# Altium schematic sheet [03] - WI-FI MODULE.SchDoc: Desk Digital Clock
size A4
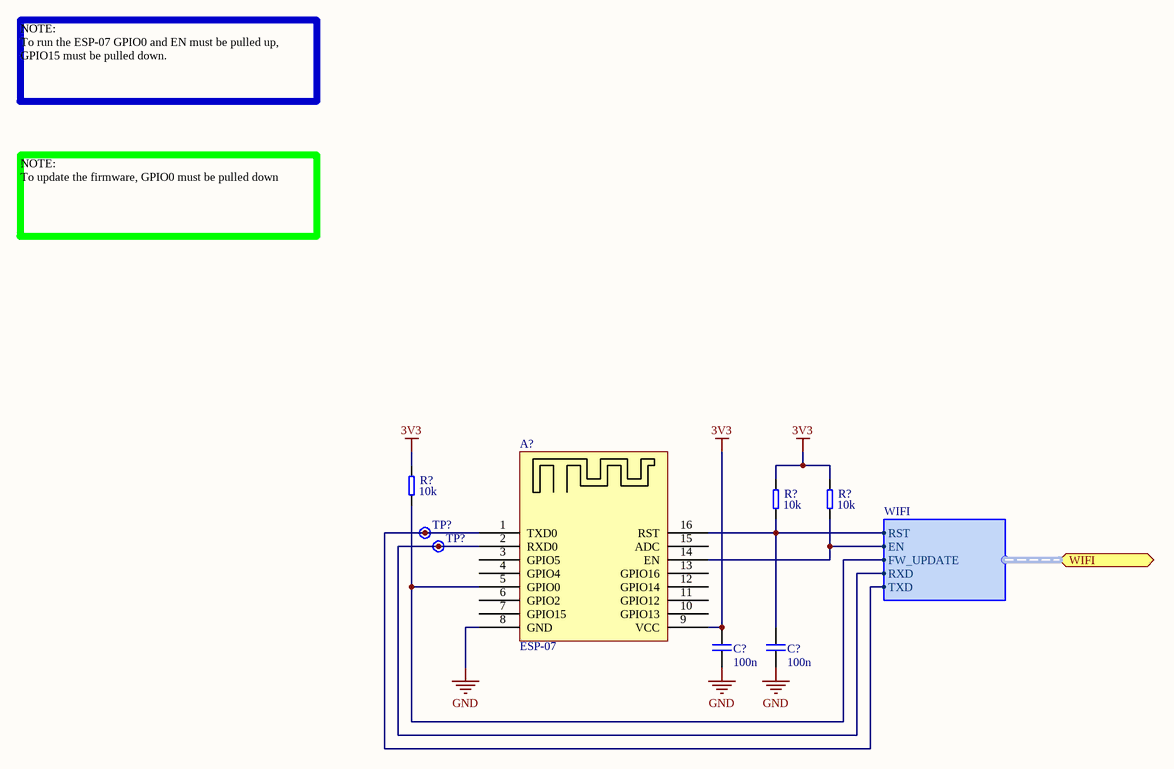
[diagram p0: [03] - WI-FI MODULE.SchDoc]

## Parts
(Parts that share a designator on the sheet are numbered #1, #2 ... from top to bottom, then left to right.)
A?  ESP-07
C?#1  100n
C?#2  100n
R?#1  10k
R?#2  10k
R?#3  10k
TP?#1  Test Point  (value not drawn)  (no BOM)
TP?#2  Test Point  (value not drawn)  (no BOM)

## Ports
WIFI (harness WIFI)

## Harnesses
WIFI: TXD, RXD, FW_UPDATE, EN, RST

## Nets
3V3: A?.9(VCC) C?#1.2 R?#1.2 R?#2.2 R?#3.2
GND: A?.8(GND) C?#1.1 C?#2.1
NetA?_1: A?.1(TXD0) TP?#1.1 ; port WIFI.TXD
NetA?_2: A?.2(RXD0) TP?#2.1 ; port WIFI.RXD
NetA?_5: A?.5(GPIO0) R?#1.1 ; port WIFI.FW_UPDATE
NetA?_14: A?.14(EN) R?#3.1 ; port WIFI.EN
NetA?_16: A?.16(RST) C?#2.2 R?#2.1 ; port WIFI.RST

Not connected (* = marked no-connect by the designer): A? 3(GPIO5) 4(GPIO4) 6(GPIO2) 7(GPIO15) 10(GPIO13) 11(GPIO12) 12(GPIO14) 13(GPIO16) 15(ADC)

## Notes on the sheet
- NOTE:
  To run the ESP-07 GPIO0 and EN must be pulled up,
  GPIO15 must be pulled down.
- NOTE:
  To update the firmware, GPIO0 must be pulled down
- Title
- Size:
- Date:
- A4
- Number:
- Time:
- Revision:
- Sheet
- of
- File:

## Library data of the parts
A? = ESP-07: ESP8266 WIFI 802.11B/G/N 160MBIT; Manufacturer: AI Thinker; Datasheet: https://wiki.ai-thinker.com/_media/esp8266/esp8266_series_modules_user_manual_v1.1.pdf; P/N: ESP-07
C?#1 C?#2 = Cap: CAPACITOR; Value: 100n
R?#1-R?#3 = Res: RESISTOR; Value: 10k